# Altium schematic sheet PWR_CTRL.SchDoc
size A3; SheetNumber: 21; SheetTotal: 22
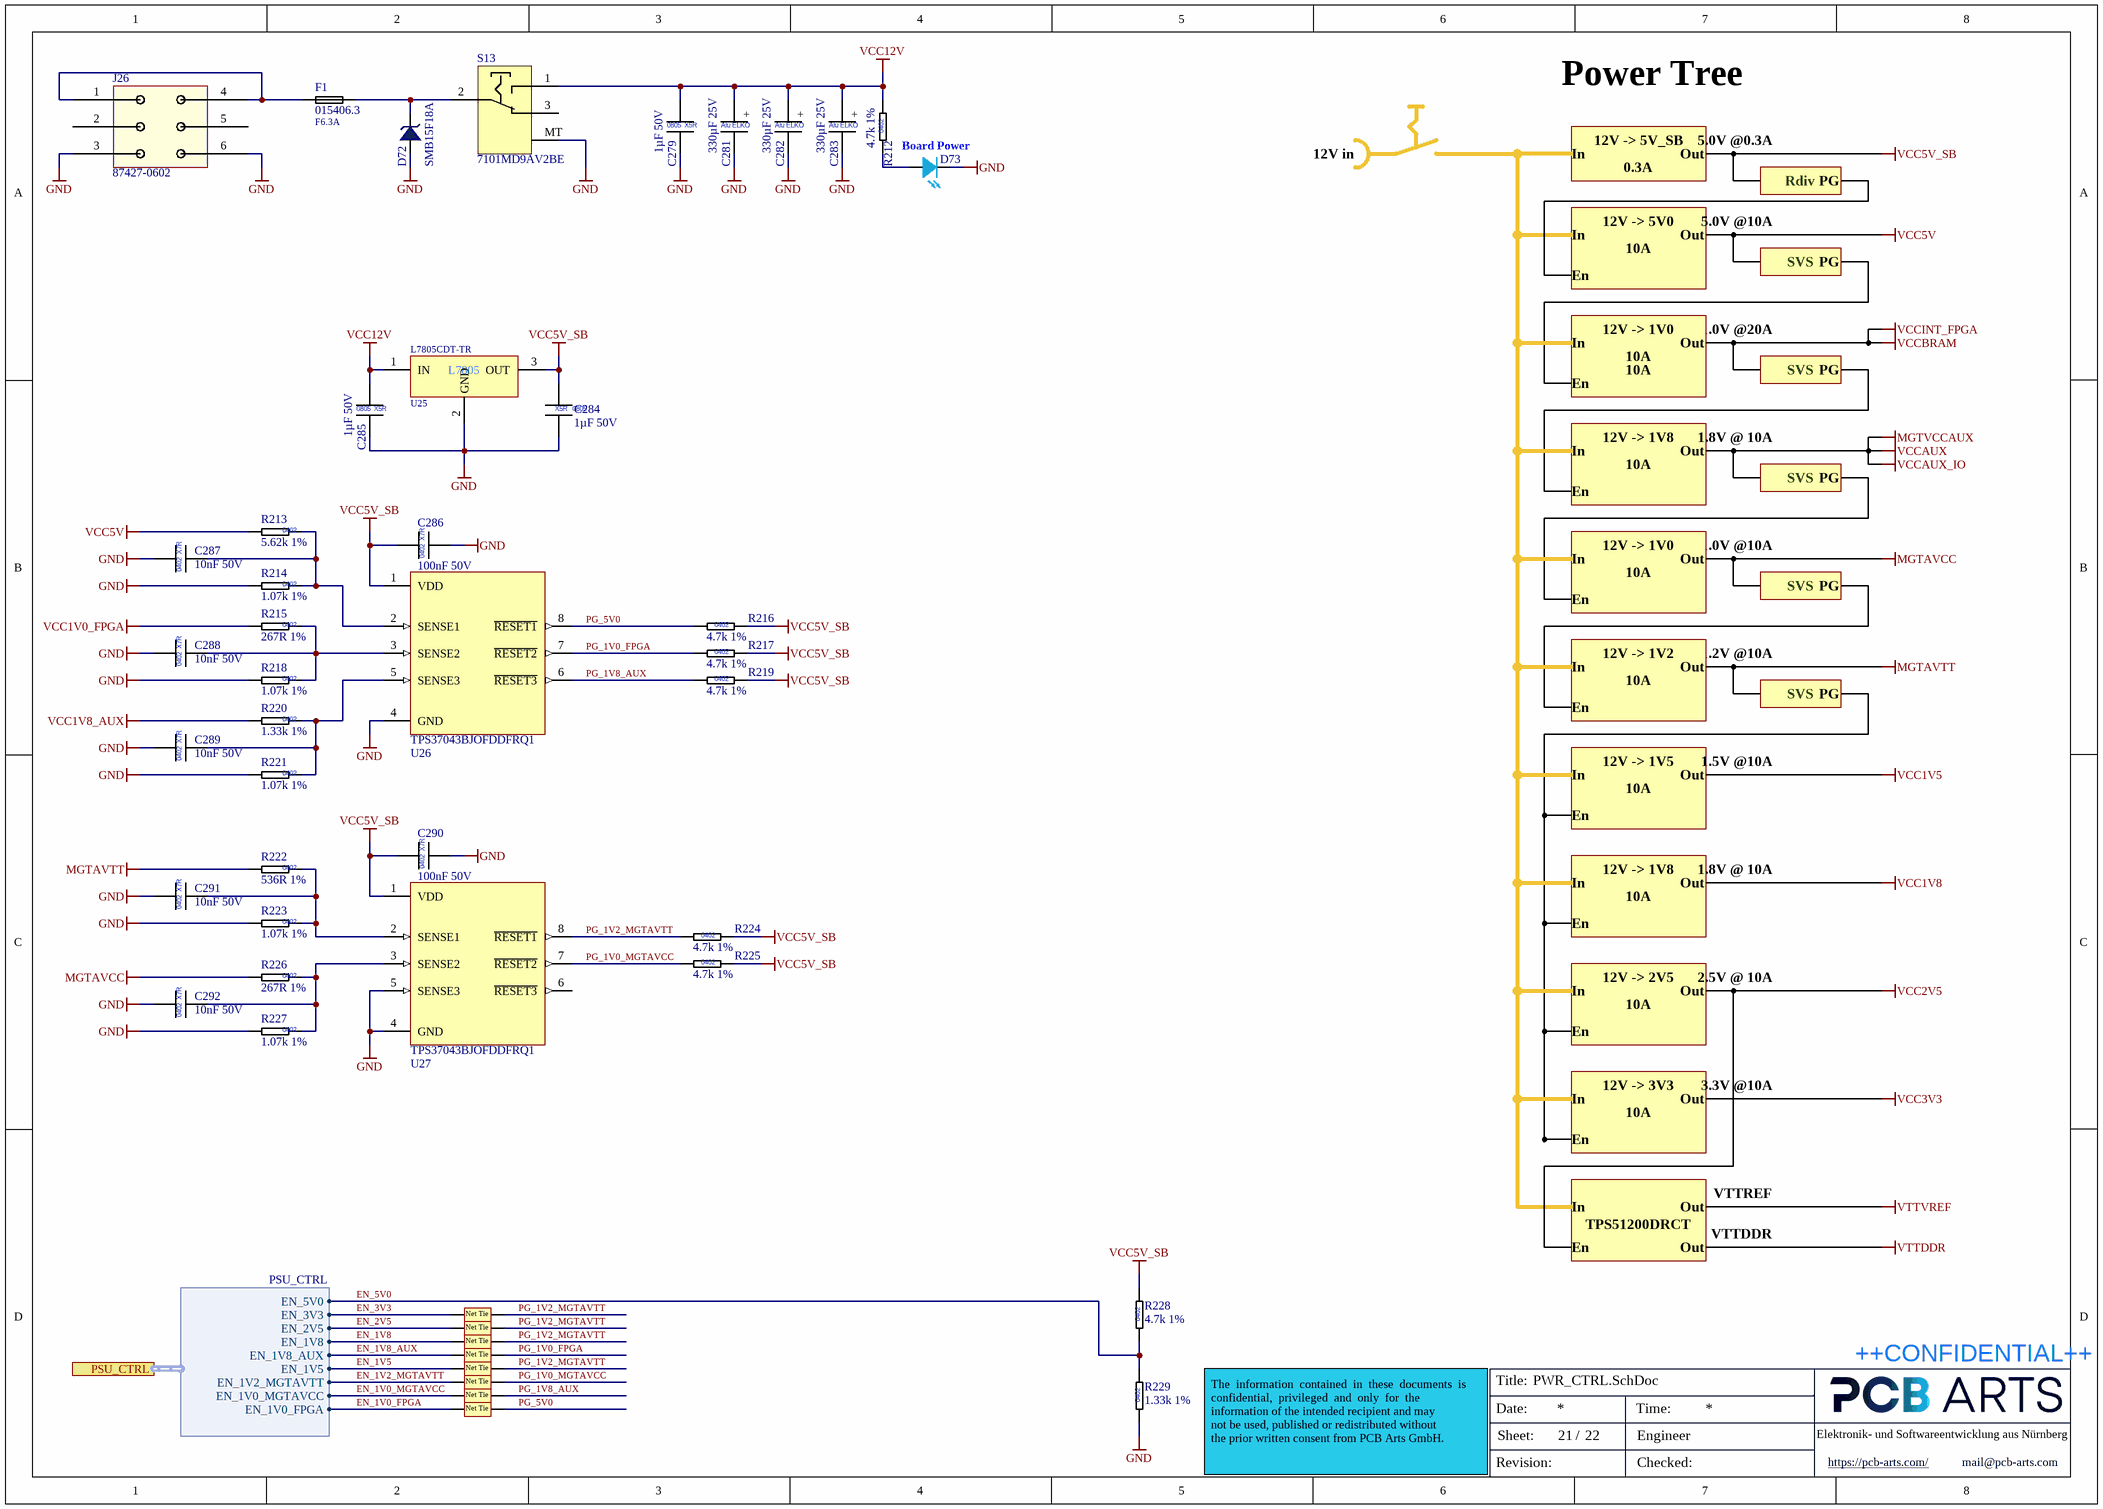
[diagram p0: PWR_CTRL.SchDoc]

## Parts
C279  1µF 50V  [CAP_0805]
C281  330µF 25V  [WCAP-PTG5_D10H12.5]
C282  330µF 25V  [WCAP-PTG5_D10H12.5]
C283  330µF 25V  [WCAP-PTG5_D10H12.5]
C284  1µF 50V  [CAP_0805]
C285  1µF 50V  [CAP_0805]
C286  100nF 50V  [CAP_0402_L]
C287  10nF 50V  [CAP_0402_L]
C288  10nF 50V  [CAP_0402_L]
C289  10nF 50V  [CAP_0402_L]
C290  100nF 50V  [CAP_0402_L]
C291  10nF 50V  [CAP_0402_L]
C292  10nF 50V  [CAP_0402_L]
D72  SMB15F18A  [DO221-AA]
D73  LTST-S270TBKT  [LED-0603 Sideview]  (value not drawn)
F1  015406.3  Current: F6.3A  [154 Series Littelfuse]
J26  87427-0602  [Molex 87427-0602]
NT1  Net Tie  [Net Tie-0.3]  (value not drawn)  (net tie, no BOM)
NT2  Net Tie  [Net Tie-0.3]  (value not drawn)  (net tie, no BOM)
NT3  Net Tie  [Net Tie-0.3]  (value not drawn)  (net tie, no BOM)
NT4  Net Tie  [Net Tie-0.3]  (value not drawn)  (net tie, no BOM)
NT5  Net Tie  [Net Tie-0.3]  (value not drawn)  (net tie, no BOM)
NT6  Net Tie  [Net Tie-0.3]  (value not drawn)  (net tie, no BOM)
NT7  Net Tie  [Net Tie-0.3]  (value not drawn)  (net tie, no BOM)
NT8  Net Tie  [Net Tie-0.3]  (value not drawn)  (net tie, no BOM)
R212  4.7k 1%  [RES_0402_L]
R213  5.62k 1%  [RES_0402_L]
R214  1.07k 1%  [RES_0402_L]
R215  267R 1%  [RES_0402_L]
R216  4.7k 1%  [RES_0402_L]
R217  4.7k 1%  [RES_0402_L]
R218  1.07k 1%  [RES_0402_L]
R219  4.7k 1%  [RES_0402_L]
R220  1.33k 1%  [RES_0402_L]
R221  1.07k 1%  [RES_0402_L]
R222  536R 1%  [RES_0402_L]
R223  1.07k 1%  [RES_0402_L]
R224  4.7k 1%  [RES_0402_L]
R225  4.7k 1%  [RES_0402_L]
R226  267R 1%  [RES_0402_L]
R227  1.07k 1%  [RES_0402_L]
R228  4.7k 1%  [RES_0402_L]
R229  1.33k 1%  [RES_0402_L]
S13  7101MD9AV2BE  [7101MD9AV2BE]
U25  L7805CDT-TR  [DPAK230P991X241-3N]
U26  TPS37043BJOFDDFRQ1  [SOT65P295X160-8N]
U27  TPS37043BJOFDDFRQ1  [SOT65P295X160-8N]

## Ports
PSU_CTRL (harness PSU_CTRL, see Top-Level-Sheet[3C], Buck Modules[1D])

## Harnesses
PSU_CTRL: EN_1V8_AUX, EN_1V5, EN_1V2_MGTAVTT, EN_1V0_MGTAVCC, EN_1V8, EN_1V0_FPGA, EN_2V5, EN_3V3, EN_5V0

## Nets
GND: C279.2 C281.2 C282.2 C283.2 C284.2 C285.2 C286.2 C287.1 C288.1 C289.1 C290.2 C291.1 C292.1 D72.2 D73.1 J26.3 J26.6 R214.2 R218.2 R221.2 R223.2 R227.2 R229.1 S13.MT U25.2(GND) U26.4(GND) U27.4(GND) U27.5(SENSE3)
MGTAVCC: R226.2
MGTAVTT: R222.2
VCC1V0_FPGA: R215.2
VCC1V8_AUX: R220.2
VCC5V: R213.2
VCC5V_SB: C284.1 C286.1 C290.1 R216.2 R217.2 R219.2 R224.2 R225.2 R228.2 U25.3(OUT) U26.1(VDD) U27.1(VDD)
VCC12V: C279.1 C281.1 C282.1 C283.1 C285.1 R212.2 S13.1 U25.1(IN)
EN_1V0_FPGA: NT8.1 ; port PSU_CTRL.EN_1V0_FPGA
EN_1V0_MGTAVCC: NT7.1 ; port PSU_CTRL.EN_1V0_MGTAVCC
EN_1V2_MGTAVTT: NT6.1 ; port PSU_CTRL.EN_1V2_MGTAVTT
EN_1V5: NT5.1 ; port PSU_CTRL.EN_1V5
EN_1V8: NT3.1 ; port PSU_CTRL.EN_1V8
EN_1V8_AUX: NT4.1 ; port PSU_CTRL.EN_1V8_AUX
EN_2V5: NT2.1 ; port PSU_CTRL.EN_2V5
EN_3V3: NT1.1 ; port PSU_CTRL.EN_3V3
EN_5V0: R228.1 R229.2 ; port PSU_CTRL.EN_5V0
PG_1V0_FPGA: NT4.2 R217.1 U26.7(~{RESET2})
PG_1V0_MGTAVCC: NT6.2 R225.1 U27.7(~{RESET2})
PG_1V2_MGTAVTT: NT1.2 NT2.2 NT3.2 NT5.2 R224.1 U27.8(~{RESET1})
PG_1V8_AUX: NT7.2 R219.1 U26.6(~{RESET3})
PG_5V0: NT8.2 R216.1 U26.8(~{RESET1})
NetC287_2: C287.2 R213.1 R214.1 U26.2(SENSE1)
NetC288_2: C288.2 R215.1 R218.1 U26.3(SENSE2)
NetC289_2: C289.2 R220.1 R221.1 U26.5(SENSE3)
NetC291_2: C291.2 R222.1 R223.1 U27.2(SENSE1)
NetC292_2: C292.2 R226.1 R227.1 U27.3(SENSE2)
NetD72_1: D72.1 F1.2 S13.2
NetD73_2: D73.2 R212.1
NetF1_1: F1.1 J26.1 J26.4

Not connected (* = marked no-connect by the designer): J26 2 5; S13 3; U27 6(~{RESET3})

## Notes on the sheet
- Power Tree
- Board Power
- 12V in
- In
- 12V -> 5V_SB
- 0.3A
- Out
- 5.0V @0.3A
- Rdiv
- PG
- 12V -> 5V0
- 10A
- 5.0V @10A
- En
- SVS
- 12V -> 1V0
- 1.0V @20A
- 12V -> 1V8
- 1.8V @ 10A
- 1.0V @10A
- 12V -> 1V2
- 1.2V @10A
- 12V -> 1V5
- 1.5V @10A
- 12V -> 2V5
- 2.5V @ 10A
- 12V -> 3V3
- 3.3V @10A
- VTTREF
- TPS51200DRCT
- VTTDDR
- Labels drawn without touching a wire or pin: MGTAVCC, MGTAVTT, MGTVCCAUX, VCC1V5, VCC1V8, VCC2V5, VCC3V3, VCC5V, VCC5V_SB, VCCAUX, VCCAUX_IO, VCCBRAM, VCCINT_FPGA, VTTDDR, VTTVREF
- Title:
- ++CONFIDENTIAL++
- Date:
- Sheet:
- /
- Time:
- Engineer
- Elektronik- und Softwareentwicklung aus Nürnberg
- The  information  contained  in  these  documents  is  confidential,  privileged  and  only  for  the
  information of the intended recipient and may
  not be used, published or redistributed without
  the prior written consent from PCB Arts GmbH.
- Revision:
- Checked:
- https://pcb-arts.com/
- mail@pcb-arts.com
- (in symbol CAP_0402_10nF_50V) X7R; 0402
- (in symbol CAP_0402_100nF_50V) X7R; 0402
- (in symbol CAP_0805_1µF_50V) 0805; X5R
- (in symbol CAP_D10L12.5_330µF_25V) +; Alu ELKO
- (in symbol L7805CDT-TR_Linear Voltage Regulators 5.0V 1.0A) L7805
- (in symbol RES_0402_1.07k_1%) 0402
- (in symbol RES_0402_1.33k_1%) 0402
- (in symbol RES_0402_4.7k_1%) 0402
- (in symbol RES_0402_5.62k_1%) 0402
- (in symbol RES_0402_267R_1%) 0402
- (in symbol RES_0402_536R_1%) 0402

## Library data of the parts
C279 C284 C285 = CAP_0805_1µF_50V: Multilayer Ceramic Capacitors MLCC - SMD/SMT 0805 50VDC; Manufacturer 1: Samsung Electro-Mechanics; Manufacturer 1 Prt. Nr.: CL21B105KBFNNNG; Manufacturer 2 Prt. Nr.: UMK212BJ105KGHT; Manufacturer 2: Taiyo Yuden
C281-C283 = CAP_D10L12.5_330µF_25V: Organische Polymer-Aluminiumkondensatoren 330uF 25 Volts 20% AEC-Q200; Manufacturer 1: Würth Elektronik; Manufacturer 1 Prt. Nr.: 870025575009
C286 C290 = CAP_0402_100nF_50V: Multilayer Ceramic Capacitors MLCC - SMD/SMT 0402 50VDC; Manufacturer 1: Murata Electronics; Manufacturer 1 Prt. Nr.: GCM155L8EH104KE07D; Manufacturer 2 Prt. Nr.: UMK105B7104KV-FR; Manufacturer 2: TDK
C287-C289 C291 C292 = CAP_0402_10nF_50V: Multilayer Ceramic Capacitors MLCC - SMD/SMT 0402 50VDC; Manufacturer 1: Wurth Elektronik; Manufacturer 1 Prt. Nr.: 885012205067; Manufacturer 2 Prt. Nr.: AC0402KPX7R9BB103; Manufacturer 2: Yageo
D72 = SMB15F18A_ESD-Entstörer/TVS-Dioden 1500 W, 18 V TVS: ESD-Entstörer/TVS-Dioden 1500 W, 18 V TVS; Manufacturer 1: STMicroelectronics; Manufacturer 1 Prt. Nr.: SMB15F18A
D73 = LED 0603 Blue Sideview: BLUE  0603 Light Emitting Diode; Manufacturer 1: lite-On; Manufacturer 1 Prt. Nr.: LTST-S270TBKT; Color: Blue
F1 = 015406.3_SMD Ceramic Holder with Fuse - Fast 6.3A: SMD Ceramic Holder with Fuse - Fast 6.3A; Manufacturer 1: Littelfuse; Manufacturer 1 Prt. Nr.: 015406.3
J26 = 87427-0602_Mini-Fit Jr. Right angle Header, 4.20mm Pitch, Dual Row, 6 Circuits: Mini-Fit Jr. Right angle Header, 4.20mm Pitch, Dual Row, 6 Circuits; Manufacturer 1: MOLEX; Manufacturer 1 Prt. Nr.: 874270602
R212 R216 R217 R219 R224 R225 R228 = RES_0402_4.7k_1%: Thick Film Resistors - SMD 4.7kOhm 1%; Manufacturer 1: Vishay / Dale; Manufacturer 1 Prt. Nr.: CRCW04024K70FKEDC; Manufacturer 2 Prt. Nr.: RC0402FR-134K7L; Manufacturer 2: Yageo
R213 = RES_0402_5.62k_1%: Thick Film Resistors - SMD 5.62kOhm 1%; Manufacturer 1: Vishay / Dale; Manufacturer 1 Prt. Nr.: CRCW04025K62FKEDC; Manufacturer 2 Prt. Nr.: AC0402FR-7W5K62L; Manufacturer 2: Yageo
R214 R218 R221 R223 R227 = RES_0402_1.07k_1%: Thick Film Resistors - SMD 1.07kOhm 1%; Manufacturer 1: Vishay / Dale; Manufacturer 1 Prt. Nr.: CRCW04021K07FKEDC; Manufacturer 2 Prt. Nr.: AC0402FR-071K07L; Manufacturer 2: Yageo
R215 R226 = RES_0402_267R_1%: Thick Film Resistors - SMD 267Ohm 1%; Manufacturer 1: Vishay / Dale; Manufacturer 1 Prt. Nr.: CRCW0402267RFKED; Manufacturer 2 Prt. Nr.: RC0402FR-07267RL; Manufacturer 2: Yageo
R220 R229 = RES_0402_1.33k_1%: Thick Film Resistors - SMD 1.33kOhm 1%; Manufacturer 1: Vishay / Dale; Manufacturer 1 Prt. Nr.: CRCW04021K33FKEDC; Manufacturer 2 Prt. Nr.: AC0402FR-071K33L; Manufacturer 2: Yageo
R222 = RES_0402_536R_1%: Thick Film Resistors - SMD 536Ohm 1%; Manufacturer 1: Vishay / Dale; Manufacturer 1 Prt. Nr.: CRCW0402536RFKED; Manufacturer 2 Prt. Nr.: RC0402FR-07536RL; Manufacturer 2: Yageo
S13 = 7101MD9AV2BE_Kippschalter SPDT Right Angle Vertical: Kippschalter SPDT Right Angle Vertical; Manufacturer 1: C&K; Manufacturer 1 Prt. Nr.: 7101MD9AV2BE
U25 = L7805CDT-TR_Linear Voltage Regulators 5.0V 1.0A: Linear Voltage Regulators 5.0V 1.0A Positive; Manufacturer 1: STMicroelectronics; Manufacturer 1 Prt. Nr.: L7805CDT-TR
U26 U27 = TPS37043BJOFDDFRQ1_Triple Supply Voltage Window Supervisors: Triple Supply Voltage Window Supervisors With Fixed Delay, Open Drain Output; Manufacturer 1: Texas Instruments; Manufacturer 1 Prt. Nr.: TPS37043BJOFDDFRQ1